# Altium project STM32-ROMI_Rev_A_Reworks.PrjPcb (part 1 of 3)
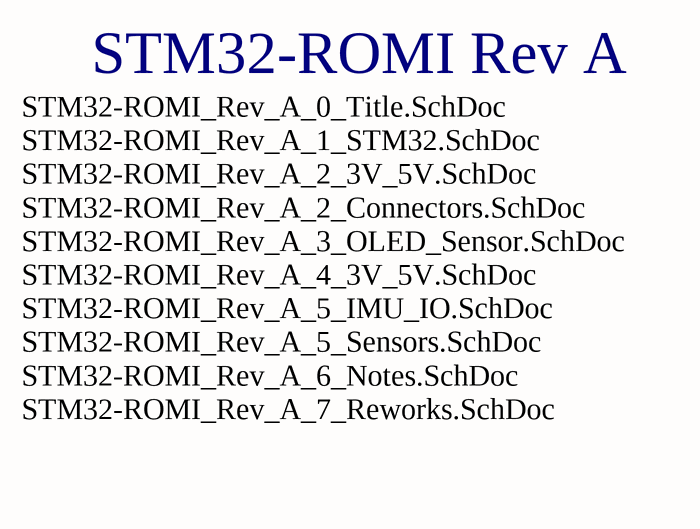
[diagram p0: STM32-ROMI_Rev_A_0_Title.SchDoc]
6 sheets, 199 parts. Net scope: global (net labels, ports and power ports of the same name join across sheets).
Board file: STM32-ROMI_Rev_A_Reworks.PcbDoc
Sheets:
  STM32-ROMI_Rev_A_0_Title.SchDoc
  STM32-ROMI_Rev_A_1_STM32.SchDoc
  STM32-ROMI_Rev_A_2_Connectors.SchDoc
  STM32-ROMI_Rev_A_3_OLED_Sensor.SchDoc
  STM32-ROMI_Rev_A_4_3V_5V.SchDoc
  STM32-ROMI_Rev_A_5_IMU_IO.SchDoc

## Sheet STM32-ROMI_Rev_A_0_Title.SchDoc
size A4; Date: 9252020; Author: Kyle R; Organization: Altium Limited; Address1: L3, 12a Rodborough Rd; Address2: Frenchs Forest; Address3: NSW; Address4: Australia 2086; DocumentNumber: 09252020; SheetNumber: 0; SheetTotal: 7; Time: Title Block

### Notes on the sheet
- STM32-ROMI Rev A
- STM32-ROMI_Rev_A_0_Title.SchDoc
  STM32-ROMI_Rev_A_1_STM32.SchDoc
  STM32-ROMI_Rev_A_2_3V_5V.SchDoc
  STM32-ROMI_Rev_A_2_Connectors.SchDoc
  STM32-ROMI_Rev_A_3_OLED_Sensor.SchDoc
  STM32-ROMI_Rev_A_4_3V_5V.SchDoc
  STM32-ROMI_Rev_A_5_IMU_IO.SchDoc
  STM32-ROMI_Rev_A_5_Sensors.SchDoc
  STM32-ROMI_Rev_A_6_Notes.SchDoc
  STM32-ROMI_Rev_A_7_Reworks.SchDoc
- Title
- Size:
- Date:
- A4
- Number:
- Time:
- Revision:
- Sheet
- of
- File:

## Sheet STM32-ROMI_Rev_A_1_STM32.SchDoc
size A4; Organization: Altium Limited; Address1: L3, 12a Rodborough Rd; Address2: Frenchs Forest; Address3: NSW; Address4: Australia 2086
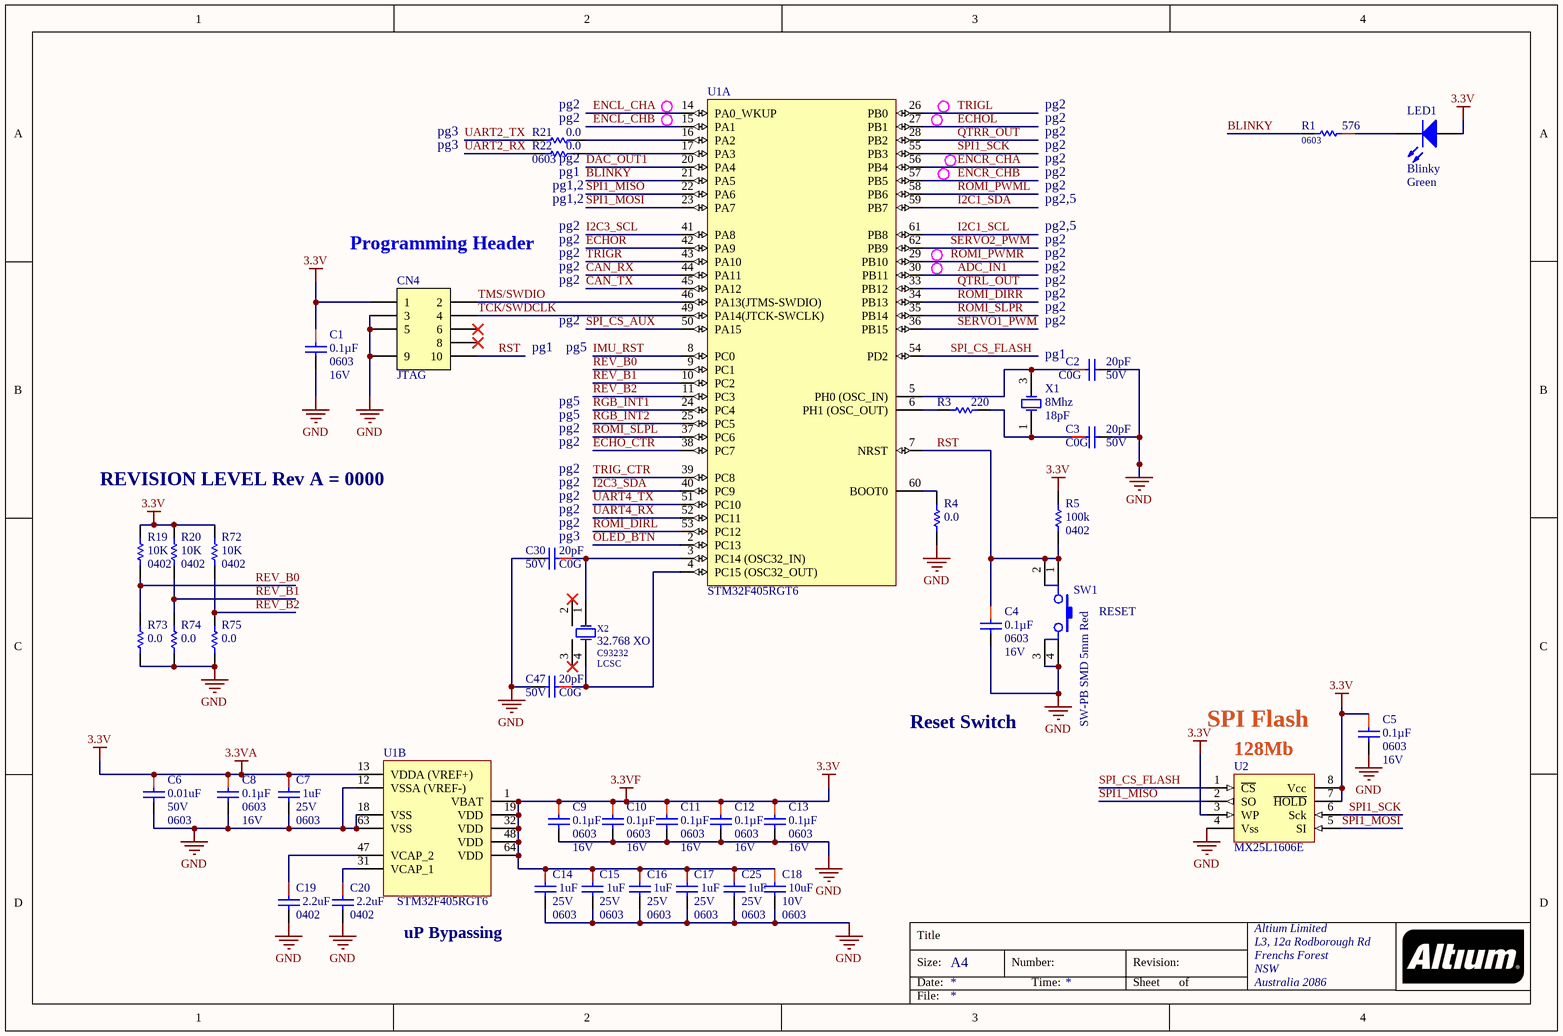
[diagram p1: STM32-ROMI_Rev_A_1_STM32.SchDoc]

### Parts
C1  Capacitance: 0.1µF  Package / Case: 0603  Voltage - Rated: 16V  [CAPC0603(1608)_L]  (hidden comment: 0.1uF)
C2  Voltage - Rated: 50V  Temperature Coefficient: C0G  Capacitance: 20pF  [CAPC0402(1005)_L]  (hidden comment: 20pF 0402)
C3  Voltage - Rated: 50V  Temperature Coefficient: C0G  Capacitance: 20pF  [CAPC0402(1005)_L]  (hidden comment: 20pF 0402)
C4  Capacitance: 0.1µF  Package / Case: 0603  Voltage - Rated: 16V  [CAPC0603(1608)_L]  (hidden comment: 0.1uF)
C5  Capacitance: 0.1µF  Package / Case: 0603  Voltage - Rated: 16V  [CAPC0603(1608)_L]  (hidden comment: 0.1uF)
C6  0.01uF  Voltage - Rated: 50V  Package / Case: 0603  [CAPC0603(1608)_L]
C7  1uF  Voltage - Rated: 25V  Package / Case: 0603  [CAPC0603(1608)_N]
C8  Capacitance: 0.1µF  Package / Case: 0603  Voltage - Rated: 16V  [CAPC0603(1608)_L]  (hidden comment: 0.1uF)
C9  Capacitance: 0.1µF  Package / Case: 0603  Voltage - Rated: 16V  [CAPC0603(1608)_L]  (hidden comment: 0.1uF)
C10  Capacitance: 0.1µF  Package / Case: 0603  Voltage - Rated: 16V  [CAPC0603(1608)_L]  (hidden comment: 0.1uF)
C11  Capacitance: 0.1µF  Package / Case: 0603  Voltage - Rated: 16V  [CAPC0603(1608)_L]  (hidden comment: 0.1uF)
C12  Capacitance: 0.1µF  Package / Case: 0603  Voltage - Rated: 16V  [CAPC0603(1608)_L]  (hidden comment: 0.1uF)
C13  Capacitance: 0.1µF  Package / Case: 0603  Voltage - Rated: 16V  [CAPC0603(1608)_L]  (hidden comment: 0.1uF)
C14  1uF  Voltage - Rated: 25V  Package / Case: 0603  [CAPC0603(1608)_N]
C15  1uF  Voltage - Rated: 25V  Package / Case: 0603  [CAPC0603(1608)_N]
C16  1uF  Voltage - Rated: 25V  Package / Case: 0603  [CAPC0603(1608)_N]
C17  1uF  Voltage - Rated: 25V  Package / Case: 0603  [CAPC0603(1608)_N]
C18  10uF  Voltage - Rated: 10V  Package / Case: 0603  [CAPC0603(1608)_L]
C19  2.2uF  Package / Case: 0402  [CAPC0402(1005)_L]
C20  2.2uF  Package / Case: 0402  [CAPC0402(1005)_L]
C25  1uF  Voltage - Rated: 25V  Package / Case: 0603  [CAPC0603(1608)_N]
C30  Voltage - Rated: 50V  Temperature Coefficient: C0G  Capacitance: 20pF  [CAPC0402(1005)_L]  (hidden comment: 20pF 0402)
C47  Voltage - Rated: 50V  Temperature Coefficient: C0G  Capacitance: 20pF  [CAPC0402(1005)_L]  (hidden comment: 20pF 0402)
CN4  JTAG  [BOBS FAVORITE DEBUG HDR]
LED1  Blinky  Color: Green  [SM-LED-0603]
R1  576  Part Size: 0603  [RESC0603(1608)_N]
R3  220  [RESC0402(1005)_L]
R4  Resistance (Ohms): 0.0  [RESC0402(1005)_L]  (hidden comment: 0)
R5  Supplier Device Package: 0402  Resistance (Ohms): 100k  [RESC0402(1005)_L]  (hidden comment: 100K 0402)
R19  10K  Supplier Device Package: 0402  [RESC0402(1005)_N]  (no BOM)
R20  10K  Supplier Device Package: 0402  [RESC0402(1005)_N]  (no BOM)
R21  Resistance (Ohms): 0.0  [RESC0603(1608)_N]  (hidden comment: 0 0603)
R22  Resistance (Ohms): 0.0  Package / Case: 0603  [RESC0603(1608)_N]  (hidden comment: 0 0603)
R72  10K  Supplier Device Package: 0402  [RESC0402(1005)_N]  (no BOM)
R73  Resistance (Ohms): 0.0  [RESC0402(1005)_L]  (hidden comment: 0)
R74  Resistance (Ohms): 0.0  [RESC0402(1005)_L]  (hidden comment: 0)
R75  Resistance (Ohms): 0.0  [RESC0402(1005)_L]  (hidden comment: 0)
SW1  RESET  [SW TACT Red 6mm x 6mm]
U1  STM32F405RGT6  [STM-LQFP64_N]  (parts A,B of 2)
U2  MX25L1606E  [SOG.050/8D]
X1  8Mhz  Load Capacitance: 18pF  [SMXOSC/5x3.2]
X2  32.768 XO  Supplier Part Number 2: C93232  Supplier 2: LCSC  [OSCABS]

### Nets
3.3V: C1.1 C5.1 C6.1 C7.1 C8.1 C9.1 C10.1 C11.1 C12.1 C13.1 C14.1 C15.1 C16.1 C17.1 C18.1 C25.1 CN4.1 LED1.1 R5.2 R19.2 R20.2 R72.2 U1.1(VBAT) U1.13(VDDA_(VREF+)) U1.19(VDD) U1.32(VDD) U1.48(VDD) U1.64(VDD) U2.3(WP) U2.7(~{HOLD}) U2.8(Vcc)  [also labelled 3.3VA, 3.3VF]
GND: C1.2 C2.2 C3.2 C4.2 C5.2 C6.2 C7.2 C8.2 C9.2 C10.2 C11.2 C12.2 C13.2 C14.2 C15.2 C16.2 C17.2 C18.2 C19.2 C20.2 C25.2 C30.2 C47.2 CN4.3 CN4.5 CN4.9 R4.1 R73.1 R74.1 R75.1 SW1.3 SW1.4 U1.12(VSSA_(VREF-)) U1.18(VSS) U1.63(VSS) U2.4(Vss)
ADC_IN1: U1.30(PB11)
BLINKY: R1.2 U1.21(PA5)
CAN_RX: U1.44(PA11)
CAN_TX: U1.45(PA12)
DAC_OUT1: U1.20(PA4)
ECHO_CTR: U1.38(PC7)
ECHOL: U1.27(PB1)
ECHOR: U1.42(PA9)
ENCL_CHA: U1.14(PA0_WKUP)
ENCL_CHB: U1.15(PA1)
ENCR_CHA: U1.56(PB4)
ENCR_CHB: U1.57(PB5)
I2C1_SCL: U1.61(PB8)
I2C1_SDA: U1.59(PB7)
I2C3_SCL: U1.41(PA8)
I2C3_SDA: U1.40(PC9)
IMU_RST: U1.8(PC0)
OLED_BTN: U1.2(PC13)
QTRL_OUT: U1.33(PB12)
QTRR_OUT: U1.28(PB2)
REV_B0: R19.1 R73.2 U1.9(PC1)
REV_B1: R20.1 R74.2 U1.10(PC2)
REV_B2: R72.1 R75.2 U1.11(PC3)
RGB_INT1: U1.24(PC4)
RGB_INT2: U1.25(PC5)
ROMI_DIRL: U1.53(PC12)
ROMI_DIRR: U1.34(PB13)
ROMI_PWML: U1.58(PB6)
ROMI_PWMR: U1.29(PB10)
ROMI_~{SLPL}: U1.37(PC6)
ROMI_~{SLPR}: U1.35(PB14)
RST: C4.1 CN4.10 R5.1 SW1.1 SW1.2 U1.7(NRST)
SERVO1_PWM: U1.36(PB15)
SERVO2_PWM: U1.62(PB9)
SPI1_MISO: U1.22(PA6) U2.2(SO)
SPI1_MOSI: U1.23(PA7) U2.5(SI)
SPI1_SCK: U1.55(PB3) U2.6(Sck)
SPI_CS_AUX: U1.50(PA15)
SPI_CS_FLASH: U1.54(PD2) U2.1(~{CS})
TCK/SWDCLK: CN4.4 U1.49(PA14(JTCK-SWCLK))
TMS/SWDIO: CN4.2 U1.46(PA13(JTMS-SWDIO))
TRIG_CTR: U1.39(PC8)
TRIGL: U1.26(PB0)
TRIGR: U1.43(PA10)
UART2_RX: R22.2
UART2_TX: R21.2
UART4_RX: U1.52(PC11)
UART4_TX: U1.51(PC10)
NetC2_1: C2.1 U1.5(PH0_(OSC_IN)) X1.3(OSC2)
NetC3_1: C3.1 R3.1 X1.1(OSC1)
NetC19_1: C19.1 U1.47(VCAP_2)
NetC20_1: C20.1 U1.31(VCAP_1)
NetC30_1: C30.1 U1.3(PC14_(OSC32_IN)) X2.1(OSC1)
NetC47_1: C47.1 U1.4(PC15_(OSC32_OUT)) X2.4(OSC2)
NetLED1_2: LED1.2 R1.1
NetR3_2: R3.2 U1.6(PH1_(OSC_OUT))
NetR4_2: R4.2 U1.60(BOOT0)
NetR21_1: R21.1 U1.16(PA2)
NetR22_1: R22.1 U1.17(PA3)

Not connected (* = marked no-connect by the designer): CN4 6* 8*; X1 2(NC) 4(NC); X2 2(NC)* 3(NC)*

### Notes on the sheet
- pg2
- pg3
- (near R21) pg2
- (near R22) pg1
- (near R22) pg2
- (near CN4) Programming Header
- pg1,2
- pg2,5
- pg1
- pg5
- REVISION LEVEL Rev A = 0000
- (near C30) pg2
- (near C30) pg3
- Reset Switch
- SPI Flash
- (near U2) 128Mb
- uP Bypassing
- Title
- Size:
- Date:
- A4
- Number:
- Time:
- Revision:
- Sheet
- of
- File:

### Library data of the parts
C1 C4 C5 C8-C13 = CAP CER 0.1UF 16V 10% X7R 0603: 0.1uF 0603 16V; Manufacturer: Kemet; Manufacturer Part Number: C0603C104K4RACTU; Tolerance: ±10%; Temperature Coefficient: X7R; Supplier 1: Digi-Key; RoHS: RoHS Compliant; Category: Capacitors; Stock 1: 2360000; Pricing 1: 4000=0.00414, 8000=0.00378, 12000=0.0036, 28000=0.00342, 100000=0.00248 (USD); Packaging: Tape & Reel (TR); Mounting Type: Surface Mount, MLCC; Operating Temperature: -55°C ~ 125°C; Applications: General Purpose; Ratings: -; Size / Dimension: 0.063" L x 0.031" W (1.60mm x 0.80mm); Height - Seated (Max): -; Thickness (Max): 0.034" (0.87mm); Lead Spacing: -; Features: -; Lead Style: -; ComponentLink1URL: http://www.kemet.com/datasheets&C0603C104K4RACTU; ComponentLink1Description: http://www.kemet.com/datasheets&C0603C104K4RACTU; Supplier Part Number 1: 399-1096-2-ND
C2 C3 C30 C47 = CAP CER 20PF 50V 2% NP0 0402: Manufacturer: Murata Electronics North America; Manufacturer Part Number: GRM1555C1H200GA01D; Tolerance: ±2%; ClassName: *; Supplier 1: Digi-Key; RoHS: RoHS Compliant; Category: Capacitors; Stock 1: 80973; Pricing 1: 1=0.11, 10=0.082, 50=0.0444, 100=0.0376, 250=0.03076, 500=0.02632, 1000=0.0201, 5000=0.01675 (USD); Packaging: Cut Tape (CT); Mounting Type: Surface Mount, MLCC; Operating Temperature: -55°C ~ 125°C; Applications: General Purpose; Ratings: -; Size / Dimension: 0.039" L x 0.020" W (1.00mm x 0.50mm); Height - Seated (Max): -; Thickness (Max): 0.022" (0.55mm); Lead Spacing: -; Features: -; Lead Style: -; ComponentLink1URL: http://www.murata.com/~/media/webrenewal/support/library/catalog/products/capacitor/mlcc/c02e.ashx; ComponentLink1Description: http://www.murata.com/~/media/webrenewal/support/library/catalog/products/capacitor/mlcc/c02e.ashx; Supplier Part Number 1: 490-6217-1-ND; Creator: osman
C6 = CAP CER 0.01uF 50V 10% X7R 0603: 0.01uF 50V 0603; Manufacturer: Kemet; Manufacturer Part Number: C0603C103K5RACTU; Capacitance: 10000pF; Tolerance: ±10%; Temperature Coefficient: X7R; ClassName: MCU; Supplier 1: Digi-Key; RoHS: RoHS Compliant; Category: Capacitors; Stock 1: 1304139; Pricing 1: 1=0.1, 10=0.02, 25=0.014, 50=0.0106, 100=0.009, 250=0.00736, 1000=0.0048 (USD); Packaging: Cut Tape (CT); Mounting Type: Surface Mount, MLCC; Operating Temperature: -55°C ~ 125°C; Applications: General Purpose; Ratings: -; Size / Dimension: 0.063" L x 0.031" W (1.60mm x 0.80mm); Height - Seated (Max): -; Thickness (Max): 0.034" (0.87mm); Lead Spacing: -; Features: -; Lead Style: -; ComponentLink1URL: http://www.kemet.com/docfinder?Partnumber=C0603C103K5RACTU; ComponentLink1Description: http://www.kemet.com/docfinder?Partnumber=C0603C103K5RACTU; Supplier Part Number 1: 399-1091-1-ND
C7 C14-C17 C25 = CAP CER 1UF 25V 10% X7R 0603: 1uF 0603 25V; Manufacturer: TDK Corporation; Manufacturer Part Number: CGA3E1X7R1E105K080AC; Tolerance: ±10%; Temperature Coefficient: X7R; Supplier 1: Digi-Key; RoHS: RoHS Compliant; Category: Capacitors; Stock 1: 360610; Pricing 1: 1=0.2, 10=0.135, 100=0.0686, 500=0.04696, 1000=0.04154 (USD); Packaging: Cut Tape (CT); Part Status: Active; Operating Temperature: -55°C ~ 125°C; Features: -; Ratings: AEC-Q200; Applications: Automotive; Failure Rate: -; Mounting Type: Surface Mount, MLCC; Size / Dimension: 0.063" L x 0.032" W (1.60mm x 0.80mm); Height - Seated (Max): -; Thickness (Max): 0.035" (0.90mm); Lead Spacing: -; Lead Style: -; ComponentLink1URL: https://product.tdk.com/info/en/catalog/datasheets/mlcc_automotive_general_en.pdf; ComponentLink1Description: https://product.tdk.com/info/en/catalog/datasheets/mlcc_automotive_general_en.pdf; Supplier Part Number 1: 445-6931-1-ND
C18 = CAP CER 10UF 10V 20% X5R 0603: 10uF 0603 10V; Manufacturer: Taiyo Yuden; Manufacturer Part Number: LMK107BBJ106MAHT; Capacitance: 10µF; Tolerance: ±20%; Temperature Coefficient: X5R; Supplier 1: Digi-Key; RoHS: RoHS Compliant; Category: Capacitors; Stock 1: 20252; Pricing 1: 1=0.4, 10=0.348, 50=0.2116, 100=0.1742, 250=0.13936, 500=0.12692, 1000=0.11224 (USD); Packaging: Cut Tape (CT); Mounting Type: Surface Mount, MLCC; Operating Temperature: -55°C ~ 85°C; Applications: Automotive; Ratings: AEC-Q200; Size / Dimension: 0.063" L x 0.031" W (1.60mm x 0.80mm); Height - Seated (Max): -; Thickness (Max): 0.035" (0.90mm); Lead Spacing: -; Features: -; Lead Style: -; ComponentLink1URL: http://www.yuden.co.jp/productdata/catalog/en/mlcc_all_e.pdf; ComponentLink1Description: http://www.yuden.co.jp/productdata/catalog/en/mlcc_all_e.pdf; Supplier Part Number 1: 587-3412-1-ND
C19 C20 = CAP CER 2.2UF 35V 10% X5R 0402: 2.2uF 0402; Manufacturer: TDK Corporation; Manufacturer Part Number: C1005X5R1V225K050BC; Tolerance: ±10%; Voltage - Rated: 35V; Temperature Coefficient: X5R; Capacitance: 2.2µF; ClassName: *; Supplier 1: Digi-Key; RoHS: RoHS Compliant; Category: Capacitors; Stock 1: 43689; Pricing 1: 1=0.32, 10=0.28, 100=0.14, 250=0.112, 500=0.102, 1000=0.092, 5000=0.076 (USD); Packaging: Cut Tape (CT); Mounting Type: Surface Mount, MLCC; Operating Temperature: -55°C ~ 85°C; Applications: General Purpose; Ratings: -; Size / Dimension: 0.039" L x 0.020" W (1.00mm x 0.50mm); Height - Seated (Max): -; Thickness (Max): 0.022" (0.55mm); Lead Spacing: -; Features: -; Lead Style: -; ComponentLink1URL: http://product.tdk.com/en/catalog/datasheets/mlcc_commercial_general_en.pdf; ComponentLink1Description: http://product.tdk.com/en/catalog/datasheets/mlcc_commercial_general_en.pdf; Creator: osman; Supplier Part Number 1: 445-9028-1-ND
CN4 = CONN-2x5-SWD: SAMTEC - FTSH-105-01-L-DV - HEADER, 1.27MM, SMD, 10WAY; PN: SAM1161-05-ND; Vendor: Digikey; Connector Type: Header, Unshrouded; Number of Positions: 10; Number of Positions Loaded: All; Pitch: 0.050" (1.27mm); Manufacturer: Samtec; MPN: FTSH-105-01-L-DV; Supplier 1: Digi-Key; Supplier Part Number 1: SAM1161-05-ND; Manufacturer Part Number: FTSH-105-01-L-DV; RoHS: RoHS Compliant; Category: Connectors, Interconnects; Stock 1: 0; Pricing 1: 1=3.42, 10=2.963, 100=2.5073, 500=1.99444, 1000=1.62404, 5000=1.48158, 10000=1.4246 (USD); Packaging: Bulk; Contact Type: Male Pin; Number of Rows: 2; Row Spacing: 0.050" (1.27mm); Contact Mating Length: 0.120" (3.05mm); Mounting Type: Surface Mount; Termination: Solder; Fastening Type: -; Features: -; Contact Finish: Gold; Contact Finish Thickness: 10µin (0.25µm); Color: Black; ComponentLink1URL: http://www.samtec.com/documents/webfiles/cpdf/FTSH-1XX-XX-XXX-DV-XXX-MKT.pdf; ComponentLink1Description: http://www.samtec.com/documents/webfiles/cpdf/FTSH-1XX-XX-XXX-DV-XXX-MKT.pdf; ClassName: mcu
LED1 = LTST-C191KGKT: LED GREEN CLEAR THIN 0603 SMD; Manufacturer: Lite-On Inc; Wavelength - Dominant: 571nm; Wavelength - Peak: 574nm; Millicandela Rating: 35mcd; Voltage - Forward (Vf) (Typ): 2V; Current - Test: 20mA; Viewing Angle: 130°; Lens Style/Size: Rectangle with Flat Top, 1.1mm x 0.8mm; Supplier 1: Digi-Key; Manufacturer Part Number: LTST-C191KGKT; RoHS: RoHS Compliant; Category: Optoelectronics; Stock 1: 84829; Pricing 1: 1=0.3, 10=0.238, 100=0.1296, 250=0.0864, 500=0.07344, 1000=0.05616, 2500=0.05076 (USD); Packaging: Cut Tape (CT); Lens Type: Clear; Package / Case: 0603 (1608 Metric); Size / Dimension: 1.60mm L x 0.80mm W; Height: 0.55mm; Mounting Type: Surface Mount; Luminous Flux @ Current - Test: -; ComponentLink1URL: http://optoelectronics.liteon.com/upload/download/DS22-2000-228/S_110_LTST-C191KGKT.pdf; ComponentLink1Description: http://optoelectronics.liteon.com/upload/download/DS22-2000-228/S_110_LTST-C191KGKT.pdf; Supplier Part Number 1: 160-1446-1-ND; ClassName: *
R1 = 576: 576OHMS ±1% 1/10W 0603; Manufacturer Part Number: 0603WAF5760T5E; Part Supplier 1: LCSC
R3 = RES 220 OHM 1% 1/10W 0402: 220 0402; Manufacturer: Panasonic Electronic Components; Manufacturer Part Number: ERJ-2RKF2200X; Tolerance: ±1%; Power (Watts): 0.1W, 1/10W; Temperature Coefficient: ±100ppm/°C; Supplier 1: Digi-Key; RoHS: RoHS Compliant; Category: Resistors; Stock 1: 372365; Pricing 1: 1=0.1, 50=0.0196, 100=0.0149, 250=0.01104, 500=0.00816, 1000=0.00544, 5000=0.00383 (USD); Packaging: Cut Tape (CT); Composition: Thick Film; Features: Automotive AEC-Q200; Operating Temperature: -55°C ~ 155°C; Package / Case: 0402 (1005 Metric); Supplier Device Package: 0402; Size / Dimension: 0.039" L x 0.020" W (1.00mm x 0.50mm); Height: 0.016" (0.40mm); Number of Terminations: 2; ComponentLink1URL: http://industrial.panasonic.com/www-cgi/jvcr13pz.cgi?E+PZ+3+AOA0002+ERJ2RKF2200X+7+WW; ComponentLink1Description: http://industrial.panasonic.com/www-cgi/jvcr13pz.cgi?E+PZ+3+AOA0002+ERJ2RKF2200X+7+WW; Supplier Part Number 1: P220LCT-ND; Creator: osman; Resistance (Ohms): 220
R4 R73-R75 = RES 0.0 OHM JUMPER 1/10W 0402: 0.0 0402; Manufacturer: Panasonic Electronic Components; Manufacturer Part Number: ERJ-2GE0R00X; Tolerance: Jumper; Power (Watts): 0.1W, 1/10W; Supplier 1: Digi-Key; RoHS: RoHS Compliant; Category: Resistors; Stock 1: 8429476; Pricing 1: 1=0.1, 50=0.0138, 100=0.0105, 250=0.0078, 500=0.00576, 1000=0.00384, 5000=0.0027 (USD); Packaging: Cut Tape (CT); Composition: Thick Film; Features: Automotive AEC-Q200; Temperature Coefficient: -; Operating Temperature: -55°C ~ 155°C; Package / Case: 0402 (1005 Metric); Supplier Device Package: 0402; Size / Dimension: 0.039" L x 0.020" W (1.00mm x 0.50mm); Height: 0.016" (0.40mm); Number of Terminations: 2; ComponentLink1URL: http://industrial.panasonic.com/www-cgi/jvcr13pz.cgi?E+PZ+3+AOA0001+ERJ2GE0R00X+7+WW; ComponentLink1Description: http://industrial.panasonic.com/www-cgi/jvcr13pz.cgi?E+PZ+3+AOA0001+ERJ2GE0R00X+7+WW; Supplier Part Number 1: P0.0JCT-ND; Creator: osman
R5 = RES 100K OHM 1% 1/16W 0402: Manufacturer: Yageo; Manufacturer Part Number: RC0402FR-07100KL; Power (Watts): 0.1W, 1/10W; Temperature Coefficient: ±100ppm/°C; Tolerance: ±1%; RoHS: RoHS Compliant; Category: Resistors; Stock 1: 3706939; Pricing 1: 1=0.1, 50=0.0196, 100=0.0149, 250=0.01104, 500=0.00816, 1000=0.00544, 5000=0.00383 (USD); Packaging: Cut Tape (CT); Composition: Thick Film; Features: Automotive AEC-Q200; Operating Temperature: -55°C ~ 155°C; Package / Case: 0402 (1005 Metric); Size / Dimension: 0.039" L x 0.020" W (1.00mm x 0.50mm); Height: 0.016" (0.40mm); Number of Terminations: 2; ComponentLink1URL: http://industrial.panasonic.com/www-cgi/jvcr13pz.cgi?E+PZ+3+AOA0002+ERJ2RKF1003X+7+WW; ComponentLink1Description: http://industrial.panasonic.com/www-cgi/jvcr13pz.cgi?E+PZ+3+AOA0002+ERJ2RKF1003X+7+WW; Supplier 1: Digi-Key; Supplier 2: Digi-Key; Supplier Part Number 1: 311-100KLRCT-ND; Supplier Part Number 2: RMCF0402FT100KCT-ND
R19 R20 R72 = RES 10K OHM 1% 1/16W 0402: 10K 0402; Manufacturer: Samsung Electro-Mechanics; Manufacturer Part Number: RC1005F103CS; Tolerance: ±1%; Power (Watts): 0.063W, 1/16W; Temperature Coefficient: ±100ppm/°C; Supplier 1: Digi-Key; RoHS: RoHS Compliant; Category: Resistors; Stock 1: 25834562; Pricing 1: 1=0.1, 10=0.021, 100=0.0086, 1000=0.00385, 2500=0.00334, 5000=0.00276 (USD); Packaging: Cut Tape (CT); Part Status: Active; Composition: Thick Film; Features: Moisture Resistant; Operating Temperature: -55°C ~ 155°C; Package / Case: 0402 (1005 Metric); Size / Dimension: 0.039" L x 0.020" W (1.00mm x 0.50mm); Height - Seated (Max): 0.016" (0.40mm); Failure Rate: -; ComponentLink1URL: http://www.samsungsem.com/kr/support/product-search/chip-resistor/RC1005F103CS.jsp; ComponentLink1Description: http://www.samsungsem.com/kr/support/product-search/chip-resistor/RC1005F103CS.jsp; Supplier Part Number 1: 1276-3431-1-ND
R21 R22 = RES 0.0 OHM 1/4W JUMP 0603 SMD: Manufacturer: Vishay Dale; Manufacturer Part Number: CRCW06030000Z0EAHP; Power (Watts): 1/4W; Tolerance: Jumper; Supplier 1: Digi-Key; RoHS: RoHS Compliant; Category: Resistors; Stock 1: 204741; Pricing 1: 10=0.202, 50=0.1088, 200=0.0625, 1000=0.04263 (USD); Packaging: Cut Tape (CT); Composition: Thick Film; Features: Automotive AEC-Q200 Qualified, Pulse Withstanding; Temperature Coefficient: -; Supplier Device Package: 0603 (1608 Metric); Size / Dimension: 0.063" L x 0.033" W (1.60mm x 0.85mm); Height: 0.022" (0.55mm); Number of Terminations: 2; ComponentLink1URL: http://www.vishay.com/docs/20043/crcwhpe3.pdf; ComponentLink1Description: http://www.vishay.com/docs/20043/crcwhpe3.pdf; Supplier Part Number 1: 541-0.0SBCT-ND
  R21: Package / Case: 0603
SW1 = SW-PB SMD 5mm Red: SWITCH TACTILE SPST-NO 0.05A 12V; Manufacturer: C&K Components; Manufacturer Part Number: PTS645SK50SMTR92 LFS; Switch Function: Off-Mom; Contact Rating @ Voltage: 0.05A @ 12VDC; Actuator Type: Standard; Actuator Height off PCB, from Pins: 5.00mm; Actuator Orientation: Top Actuated; Outline: 6.00mm x 6.00mm; Illumination: Non-Illuminated; Operating Force: 260gf; Actuator Material: Polyamide (PA66), Nylon 6/6; Mechanical Life: 100,000 Cycles; Published: 24-Mar-1999; LatestRevisionDate: 17-Jul-2002; LatestRevisionNote: Re-released for DXP Platform.; PackageReference: SPST-2; Publisher: Altium Limited; PackageDescription: Switch; 2 Leads; Supplier 1: Digi-Key; RoHS: RoHS Compliant; Category: Switches; Stock 1: 24906; Pricing 1: 1=0.28, 10=0.271, 25=0.262, 50=0.2524, 100=0.2384, 250=0.2244, 500=0.21506 (USD); Packaging: Cut Tape (CT); Circuit: SPST-NO; Mounting Type: Surface Mount; Termination Style: Gull Wing; Illumination Voltage (Nominal): -; Illumination Type, Color: -; Ingress Protection: -; Features: -; Switch Travel: -; Operating Temperature: -20°C ~ 60°C; ComponentLink1URL: http://www.ck-components.com/14409/pts645_25apr13.pdf/; ComponentLink1Description: http://www.ck-components.com/14409/pts645_25apr13.pdf/; Supplier Part Number 1: CKN9087CT-ND; ClassName: USwitch; Text: SW-PB SMD 5mm Red
U1 = STM32F405RGT6: IC MCU 32BIT 1MB FLASH 64LQFP; Manufacturer: STMicroelectronics; Core Processor: ARM® Cortex®-M4; Core Size: 32-Bit; Speed: 168MHz; Connectivity: CAN, I²C, IrDA, LIN, SPI, UART/USART, USB OTG; Peripherals: Brown-out Detect/Reset, DMA, I²S, LCD, POR, PWM, WDT; Number of I/O: 51; Program Memory Size: 1MB (1M x 8); RAM Size: 192K x 8; Voltage - Supply (Vcc/Vdd): 1.8 V ~ 3.6 V; Data Converters: A/D 16x12b, D/A 2x12b; Oscillator Type: Internal; Supplier 1: Digi-Key; RoHS: RoHS Compliant; Category: Integrated Circuits (ICs); Stock 1: 14614; Pricing 1: 1=10.93, 10=10.044, 100=8.4825, 500=7.5458, 1000=6.92132 (USD); Packaging: Tray; Program Memory Type: FLASH; EEPROM Size: -; Operating Temperature: -40°C ~ 85°C (TA); Package / Case: 64-LQFP; Supplier Device Package: 64-LQFP (10x10); ComponentLink1URL: http://www.st.com/web/en/resource/technical/document/datasheet/DM00037051.pdf; ComponentLink1Description: http://www.st.com/web/en/resource/technical/document/datasheet/DM00037051.pdf; Supplier Part Number 1: 497-11767-ND; Manufacturer Part Number: STM32F405RGT6
U2 = MX25L1606E: 16M NOR Flash; Manufacturer: Macronix; MPN: MX25L1606EM2I-12G; Vendor: Digikey; PN: 1092-1135-ND; Memory Type: FLASH - NOR; Memory Size: 16M (16M x 1, 8M x 2); Speed: 86MHz; Interface: SPI Serial; Voltage - Supply: 2.7 V ~ 3.6 V; Supplier 1: Digi-Key; Manufacturer Part Number: MX25L1606EM2I-12G; RoHS: RoHS Compliant; Category: Integrated Circuits (ICs); Stock 1: 1520; Pricing 1: 1=1.04, 10=0.947, 50=0.9292, 100=0.8309, 250=0.82368, 500=0.81168, 1000=0.7824, 2500=0.76032, 5000=0.7128 (USD); Packaging: Tube; Format - Memory: FLASH; Operating Temperature: -40°C ~ 85°C; Package / Case: 8-SOIC (0.209", 5.30mm Width); Supplier Device Package: 8-SOP; ComponentLink1URL: http://www.macronix.com/Lists/ApplicationNote/Attachments/654/AN055-Migrate_to_MX25L1606E_and_MX25L8006E-1.2.pdf; ComponentLink1Description: http://www.macronix.com/Lists/ApplicationNote/Attachments/654/AN055-Migrate_to_MX25L1606E_and_MX25L8006E-1.2.pdf; Supplier Part Number 1: 1092-1135-ND
X1 = CRYSTAL 8MHZ ABM3: 8Mhz ABM3 Parallel Load Crystal; Manufacturer: Abracon Corporation; Manufacturer Part Number: ABM3B-8.000MHZ-B2-T; Frequency Stability: ±50ppm; Frequency Tolerance: ±20ppm; ESR (Equivalent Series Resistance): 200 Ohm; Operating Mode: Fundamental; ClassName: MCU; Supplier 1: Digi-Key; RoHS: RoHS Compliant; Category: Crystals and Oscillators; Stock 1: 22545; Pricing 1: 1=1.04, 10=0.92, 50=0.8588, 100=0.76, 500=0.7182 (USD); Packaging: Cut Tape (CT); Type: MHz Crystal; Frequency: 8MHz; Operating Temperature: -20°C ~ 70°C; Ratings: -; Mounting Type: Surface Mount; Package / Case: 4-SMD, No Lead (DFN, LCC); Size / Dimension: 0.197" L x 0.126" W (5.00mm x 3.20mm); Height: 0.043" (1.10mm); ComponentLink1URL: http://www.abracon.com/Resonators/abm3b.pdf; ComponentLink1Description: http://www.abracon.com/Resonators/abm3b.pdf; Supplier Part Number 1: 535-9720-1-ND
X2 = DST310S 32.768KHz: SMD CRYSTAL RESONATORS 32.768KHZ ±20PPM SMD-3215_2P ROHS; Supplier 1: Digi-Key; Supplier Part Number 1: 535-10240-1-ND

## Sheet STM32-ROMI_Rev_A_2_Connectors.SchDoc
size A4; Organization: Altium Limited; Address1: L3, 12a Rodborough Rd; Address2: Frenchs Forest; Address3: NSW; Address4: Australia 2086
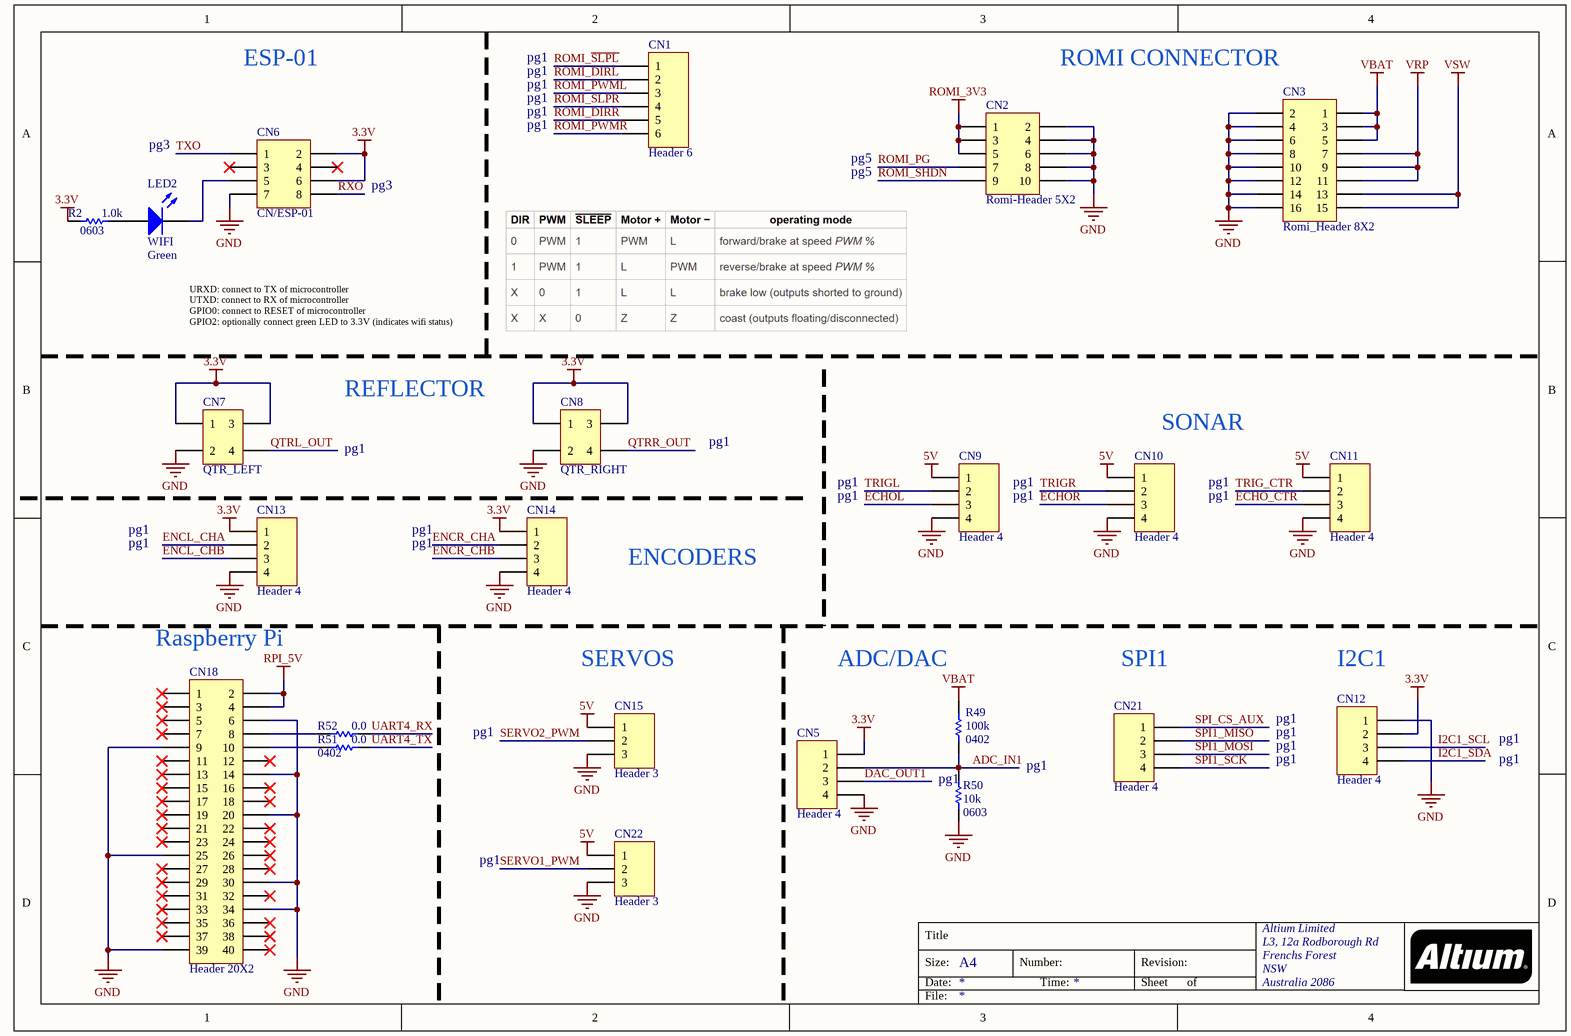
[diagram p2: STM32-ROMI_Rev_A_2_Connectors.SchDoc]

### Parts
CN1  Header 6  [PinHeader_1x06_P2.54mm_Vertical]
CN2  Romi-Header 5X2  [PinHeader_2x05_P2.54mm_Vertical - duplicate]
CN3  Romi_Header 8X2  [PinHeader_2x08_P2.54mm_Vertical]
CN5  Header 4  [HDR1X4]
CN6  CN/ESP-01  [ESP-01]
CN7  QTR_LEFT  [Molex 2x2 Microfit]
CN8  QTR_RIGHT  [Molex 2x2 Microfit]
CN9  Header 4  [HDR1X4]
CN10  Header 4  [HDR1X4]
CN11  Header 4  [HDR1X4]
CN12  Header 4  [HDR1X4]
CN13  Header 4  [HDR1X4]
CN14  Header 4  [HDR1X4]
CN15  Header 3  [HDR1X3]
CN18  Header 20X2  [Raspberry_Pi_2_3]
CN21  Header 4  [HDR1X4]
CN22  Header 3  [HDR1X3]
LED2  WIFI  Color: Green  [SM-LED-0603]
R2  Package / Case: 0603  [RESC0603(1608)_N]  (hidden comment: 1.0K)
R49  Supplier Device Package: 0402  Resistance (Ohms): 100k  [RESC0402(1005)_L]  (hidden comment: 100K 0402)
R50  Resistance (Ohms): 10k  Package / Case: 0603  [RESC0603(1608)_L]  (hidden comment: 10K 1%)
R51  Supplier Device Package: 0402  Resistance (Ohms): 0.0  [RESC0402(1005)_L]  (hidden comment: 0)
R52  Resistance (Ohms): 0.0  [RESC0402(1005)_L]  (hidden comment: 0)

### Nets
3.3V: CN5.1 CN6.2 CN6.6 CN7.1 CN7.3 CN8.1 CN8.3 CN12.2 CN13.1 CN14.1 R2.2
5V: CN9.1 CN10.1 CN11.1 CN15.1 CN22.1
GND: CN2.2 CN2.4 CN2.6 CN2.8 CN2.10 CN3.2 CN3.4 CN3.6 CN3.8 CN3.10 CN3.12 CN3.14 CN3.16 CN5.4 CN6.7 CN7.2 CN8.2 CN9.4 CN10.4 CN11.4 CN12.1 CN13.4 CN14.4 CN15.3 CN18.6 CN18.9 CN18.14 CN18.20 CN18.25 CN18.30 CN18.34 CN18.39 CN22.3 R50.1
ROMI_3V3: CN2.1 CN2.3 CN2.5
RPI_5V: CN18.2 CN18.4
VBAT: CN3.1 CN3.3 CN3.5 R49.2
VRP: CN3.7 CN3.9 CN3.11
VSW: CN3.13 CN3.15
ADC_IN1: CN5.2 R49.1 R50.2
DAC_OUT1: CN5.3
ECHO_CTR: CN11.3
ECHOL: CN9.3
ECHOR: CN10.3
ENCL_CHA: CN13.2
ENCL_CHB: CN13.3
ENCR_CHA: CN14.2
ENCR_CHB: CN14.3
I2C1_SCL: CN12.3
I2C1_SDA: CN12.4
QTRL_OUT: CN7.4
QTRR_OUT: CN8.4
ROMI_DIRL: CN1.2
ROMI_DIRR: CN1.5
ROMI_PG: CN2.7
ROMI_PWML: CN1.3
ROMI_PWMR: CN1.6
ROMI_~{SLPL}: CN1.1
ROMI_~{SLPR}: CN1.4
ROMI_SHDN: CN2.9
RXO: CN6.8
SERVO1_PWM: CN22.2
SERVO2_PWM: CN15.2
SPI1_MISO: CN21.2
SPI1_MOSI: CN21.3
SPI1_SCK: CN21.4
SPI_CS_AUX: CN21.1
TRIG_CTR: CN11.2
TRIGL: CN9.2
TRIGR: CN10.2
TXO: CN6.1
UART4_RX: R52.1
UART4_TX: R51.1
NetCN6_5: CN6.5 LED2.2
NetCN18_8: CN18.8 R52.2
NetCN18_10: CN18.10 R51.2
NetLED2_1: LED2.1 R2.1

Not connected (* = marked no-connect by the designer): CN6 3* 4*; CN18 1* 3* 5* 7* 11* 12* 13* 15* 16* 17* 18* 19* 21* 22* 23* 24* 26* 27* 28* 29* 31* 32* 33* 35* 36* 37* 38* 40*

### Notes on the sheet
- ESP-01
- pg1
- ROMI CONNECTOR
- pg3
- pg5
- URXD: connect to TX of microcontroller
  UTXD: connect to RX of microcontroller
  GPIO0: connect to RESET of microcontroller
  GPIO2: optionally connect green LED to 3.3V (indicates wifi status)
- REFLECTOR
- (near CN10) SONAR
- ENCODERS
- Raspberry Pi
- SERVOS
- ADC/DAC
- SPI1
- (near CN12) I2C1
- (near R50) pg1
- Title
- Size:
- Date:
- A4
- Number:
- Time:
- Revision:
- Sheet
- of
- File:

### Library data of the parts
CN1 = Romi_Header 6: Header, 6-Pin; Manufacturer: Sullins Connector Solutions; Manufacturer Part Number: PRPC006SAAN-RC; Connector Type: Header, Unshrouded, Breakaway; Number of Positions: 6; Number of Positions Loaded: All; Pitch: 0.100" (2.54mm); Supplier 1: Digi-Key; RoHS: RoHS Compliant; Category: Connectors, Interconnects; Stock 1: 1723; Pricing 1: 1=0.23, 10=0.205, 100=0.1689, 500=0.13352, 1000=0.11461, 5000=0.10456, 10000=0.10054 (USD); Packaging: Bulk; Contact Type: Male Pin; Number of Rows: 1; Row Spacing: -; Contact Mating Length: 0.230" (5.84mm); Mounting Type: Through Hole; Termination: Solder; Fastening Type: -; Features: -; Contact Finish: Gold; Contact Finish Thickness: Flash; Color: Black; ComponentLink1URL: http://media.digikey.com/PDF/Data%20Sheets/Sullins%20PDFs/xRxCzzzSxxN-RC_ST_11635-B.pdf; ComponentLink1Description: http://media.digikey.com/PDF/Data%20Sheets/Sullins%20PDFs/xRxCzzzSxxN-RC_ST_11635-B.pdf; Supplier Part Number 1: S1011EC-06-ND
CN2 = Romi-Header 5X2: Header, 5-Pin, Dual row; LatestRevisionDate: 17-Jul-2002; LatestRevisionNote: Re-released for DXP Platform.; Publisher: Altium Limited
CN3 = Romi_Header 8X2: Header, 8-Pin, Dual row; LatestRevisionDate: 17-Jul-2002; LatestRevisionNote: Re-released for DXP Platform.; Publisher: Altium Limited
CN5 CN9-CN14 CN21 = Header 4: Header, 4-Pin; Manufacturer: Sullins Connector Solutions; Manufacturer Part Number: PRPC004SAAN-RC; Connector Type: Header, Unshrouded, Breakaway; Number of Positions: 4; Number of Positions Loaded: All; Pitch: 0.100" (2.54mm); Supplier 1: Digi-Key; RoHS: RoHS Compliant; Category: Connectors, Interconnects; Stock 1: 0; Pricing 1: 1=0.2, 10=0.175, 100=0.1443, 500=0.1141, 1000=0.09794, 5000=0.08935, 10000=0.08591 (USD); Packaging: Bulk; Contact Type: Male Pin; Number of Rows: 1; Row Spacing: -; Contact Mating Length: 0.230" (5.84mm); Mounting Type: Through Hole; Termination: Solder; Fastening Type: -; Features: -; Contact Finish: Gold; Contact Finish Thickness: Flash; Color: Black; ComponentLink1URL: http://media.digikey.com/PDF/Data%20Sheets/Sullins%20PDFs/xRxCzzzSxxN-RC_ST_11635-B.pdf; ComponentLink1Description: http://media.digikey.com/PDF/Data%20Sheets/Sullins%20PDFs/xRxCzzzSxxN-RC_ST_11635-B.pdf; Supplier Part Number 1: S1011EC-04-ND
CN6 = CN/ESP-01: Header, 4-Pin, Dual row; LatestRevisionDate: 17-Jul-2002; LatestRevisionNote: Re-released for DXP Platform.; Publisher: Altium Limited
CN7 CN8 = MICROFIT 3.0 HDR VERT 4CKT: Molex Microfit 2x2 Vert Header; Manufacturer: Molex Inc; Manufacturer Part Number: 0430450427; Connector Type: Header, Shrouded; Number of Positions: 4; Number of Positions Loaded: All; Pitch: 0.118" (3.00mm); ClassName: *; Supplier 1: Digi-Key; RoHS: RoHS Compliant; Category: Connectors, Interconnects; Stock 1: 1962; Pricing 1: 1=1.28, 10=1.123, 50=1.0126, 100=0.9687, 250=0.8806, 500=0.79254, 1000=0.70448, 2500=0.63844, 5000=0.61642 (USD); Packaging: Tray; Contact Type: Male Pin; Number of Rows: 2; Row Spacing: 0.118" (3.00mm); Contact Mating Length: -; Mounting Type: Through Hole; Termination: Solder; Fastening Type: Locking Ramp; Features: Board Guide; Contact Finish: Tin; Contact Finish Thickness: 100µin (2.54µm); Color: Black; ComponentLink1URL: http://www.molex.com/pdm_docs/sd/430450427_sd.pdf; ComponentLink1Description: http://www.molex.com/pdm_docs/sd/430450427_sd.pdf; Supplier Part Number 1: WM10667-ND
CN15 CN22 = Header 3: Header, 3-Pin; Manufacturer: Sullins Connector Solutions; Manufacturer Part Number: PRPC003SAAN-RC; Connector Type: Header, Unshrouded, Breakaway; Number of Positions: 3; Number of Positions Loaded: All; Pitch: 0.100" (2.54mm); Supplier 1: Digi-Key; RoHS: RoHS Compliant; Category: Connectors, Interconnects; Stock 1: 0; Pricing 1: 1=0.18, 10=0.16, 100=0.132, 500=0.10438, 1000=0.0896, 5000=0.08174, 10000=0.0786 (USD); Packaging: Bulk; Contact Type: Male Pin; Number of Rows: 1; Row Spacing: -; Contact Mating Length: 0.230" (5.84mm); Mounting Type: Through Hole; Termination: Solder; Fastening Type: -; Features: -; Contact Finish: Gold; Contact Finish Thickness: Flash; Color: Black; ComponentLink1URL: http://media.digikey.com/PDF/Data%20Sheets/Sullins%20PDFs/xRxCzzzSxxN-RC_ST_11635-B.pdf; ComponentLink1Description: http://media.digikey.com/PDF/Data%20Sheets/Sullins%20PDFs/xRxCzzzSxxN-RC_ST_11635-B.pdf; Supplier Part Number 1: S1011EC-03-ND
CN18 = J/Header 20X2: Header, 20-Pin, Dual row; Manufacturer: Harwin Inc; Manufacturer Part Number: M20-9762046; Connector Type: Header, Unshrouded, Breakaway; Number of Positions: 40; Number of Positions Loaded: All; Pitch: 0.100" (2.54mm); Supplier 1: Digi-Key; RoHS: RoHS Compliant; Category: Connectors, Interconnects; Stock 1: 1666; Pricing 1: 1=1.08, 10=0.946, 25=0.8904, 50=0.8534, 100=0.8162, 250=0.742, 500=0.6678, 1000=0.5936, 2500=0.53795 (USD); Packaging: Bulk; Contact Type: Male Pin; Number of Rows: 2; Row Spacing: 0.100" (2.54mm); Contact Mating Length: 0.228" (5.80mm); Mounting Type: Through Hole; Termination: Solder; Fastening Type: -; Features: -; Contact Finish: Tin; Contact Finish Thickness: -; Color: Black; ComponentLink1URL: http://www.harwin.com/include/downloads/drawings/M20-976.PDF; ComponentLink1Description: http://www.harwin.com/include/downloads/drawings/M20-976.PDF; Supplier Part Number 1: 952-1896-ND
LED2 = LTST-C191KGKT: as LED1 on sheet STM32-ROMI_Rev_A_1_STM32; Supplier 1: Digi-Key; Manufacturer Part Number: LTST-C191KGKT; RoHS: RoHS Compliant; Category: Optoelectronics; Stock 1: 84829; Pricing 1: 1=0.3, 10=0.238, 100=0.1296, 250=0.0864, 500=0.07344, 1000=0.05616, 2500=0.05076 (USD); Packaging: Cut Tape (CT); Lens Type: Clear; Package / Case: 0603 (1608 Metric); Size / Dimension: 1.60mm L x 0.80mm W; Height: 0.55mm; Mounting Type: Surface Mount; Luminous Flux @ Current - Test: -; ComponentLink1URL: http://optoelectronics.liteon.com/upload/download/DS22-2000-228/S_110_LTST-C191KGKT.pdf; ComponentLink1Description: http://optoelectronics.liteon.com/upload/download/DS22-2000-228/S_110_LTST-C191KGKT.pdf; Supplier Part Number 1: 160-1446-1-ND; ClassName: *
R2 = RES 1K OHM 1% 1/10W 0603: 1.0K 0603; Manufacturer: Stackpole Electronics Inc.; Manufacturer Part Number: RMCF0603FT1K00; Tolerance: ±1%; Power (Watts): 0.1W, 1/10W; Temperature Coefficient: ±100ppm/°C; Supplier 1: Digi-Key; RoHS: RoHS Compliant; Category: Resistors; Stock 1: 411308; Pricing 1: 1=0.1, 10=0.02, 100=0.0081, 1000=0.00364, 2500=0.00316 (USD); Packaging: Cut Tape (CT); Part Status: Active; Composition: Thick Film; Features: Automotive AEC-Q200; Operating Temperature: -55°C ~ 155°C; Size / Dimension: 0.061" L x 0.031" W (1.55mm x 0.80mm); Height - Seated (Max): 0.022" (0.55mm); Failure Rate: -; ComponentLink1URL: https://www.seielect.com/Catalog/SEI-RMCF_RMCP.pdf; ComponentLink1Description: https://www.seielect.com/Catalog/SEI-RMCF_RMCP.pdf; Supplier Part Number 1: RMCF0603FT1K00CT-ND; Supplier Device Package: 0603; Resistance (Ohms): 1.0k
R49 = RES 100K OHM 1% 1/16W 0402: as R5 on sheet STM32-ROMI_Rev_A_1_STM32; RoHS: RoHS Compliant; Category: Resistors; Stock 1: 3706939; Pricing 1: 1=0.1, 50=0.0196, 100=0.0149, 250=0.01104, 500=0.00816, 1000=0.00544, 5000=0.00383 (USD); Packaging: Cut Tape (CT); Composition: Thick Film; Features: Automotive AEC-Q200; Operating Temperature: -55°C ~ 155°C; Package / Case: 0402 (1005 Metric); Size / Dimension: 0.039" L x 0.020" W (1.00mm x 0.50mm); Height: 0.016" (0.40mm); Number of Terminations: 2; ComponentLink1URL: http://industrial.panasonic.com/www-cgi/jvcr13pz.cgi?E+PZ+3+AOA0002+ERJ2RKF1003X+7+WW; ComponentLink1Description: http://industrial.panasonic.com/www-cgi/jvcr13pz.cgi?E+PZ+3+AOA0002+ERJ2RKF1003X+7+WW; Supplier 1: Digi-Key; Supplier 2: Digi-Key; Supplier Part Number 1: 311-100KLRCT-ND; Supplier Part Number 2: RMCF0402FT100KCT-ND
R50 = RES 10K OHM 1/10W 1% 0603 SMD: 10K 0603; Manufacturer: Panasonic Electronic Components; Manufacturer Part Number: ERJ-3EKF1002V; Power (Watts): 0.1W, 1/10W; Temperature Coefficient: ±100ppm/°C; Category: Resistors; Supplier 1: Digi-Key; RoHS: RoHS Compliant; Stock 1: 5046430; Pricing 1: 1=0.1, 50=0.015, 100=0.0114, 250=0.00844, 500=0.00624, 1000=0.00416, 2500=0.00351 (USD); Packaging: Cut Tape (CT); Tolerance: ±1%; Composition: Thick Film; Features: -; Supplier Device Package: 0603; Size / Dimension: 0.063" L x 0.031" W (1.60mm x 0.80mm); Height: 0.022" (0.55mm); Number of Terminations: 2; ComponentLink1URL: http://industrial.panasonic.com/www-cgi/jvcr13pz.cgi?E+PZ+3+AOA0002+ERJ3EKF1002V+7+WW; ComponentLink1Description: http://industrial.panasonic.com/www-cgi/jvcr13pz.cgi?E+PZ+3+AOA0002+ERJ3EKF1002V+7+WW; Supplier Part Number 1: P10.0KHCT-ND
R51 R52 = RES 0.0 OHM JUMPER 1/10W 0402: as R4 on sheet STM32-ROMI_Rev_A_1_STM32; Supplier 1: Digi-Key; RoHS: RoHS Compliant; Category: Resistors; Stock 1: 8429476; Pricing 1: 1=0.1, 50=0.0138, 100=0.0105, 250=0.0078, 500=0.00576, 1000=0.00384, 5000=0.0027 (USD); Packaging: Cut Tape (CT); Composition: Thick Film; Features: Automotive AEC-Q200; Temperature Coefficient: -; Operating Temperature: -55°C ~ 155°C; Package / Case: 0402 (1005 Metric); Size / Dimension: 0.039" L x 0.020" W (1.00mm x 0.50mm); Height: 0.016" (0.40mm); Number of Terminations: 2; ComponentLink1URL: http://industrial.panasonic.com/www-cgi/jvcr13pz.cgi?E+PZ+3+AOA0001+ERJ2GE0R00X+7+WW; ComponentLink1Description: http://industrial.panasonic.com/www-cgi/jvcr13pz.cgi?E+PZ+3+AOA0001+ERJ2GE0R00X+7+WW; Supplier Part Number 1: P0.0JCT-ND; Creator: osman
  R52: Supplier Device Package: 0402